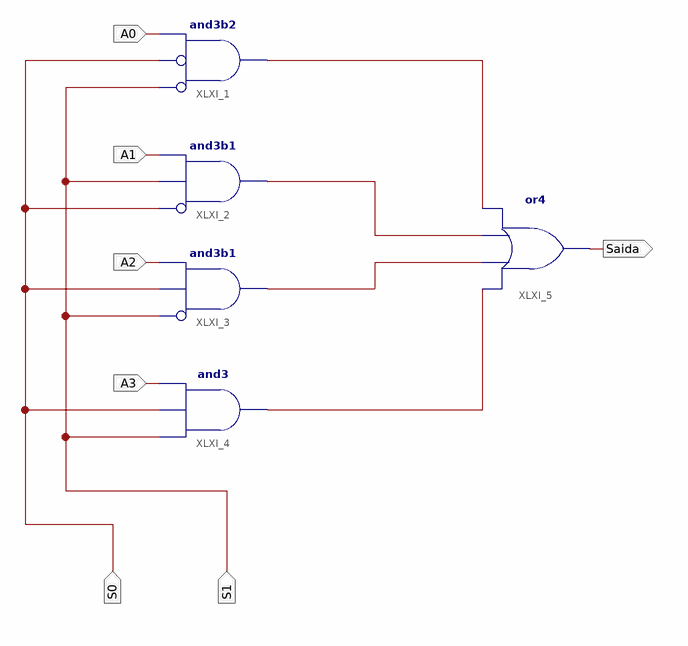
[diagram p0: schematic sheet 1]
// Xilinx ISE schematic Mut.sch (xa9500xl) as structural Verilog: 5 symbols, 7 ports
module Mut (
  input  S0,
  input  S1,
  input  A0,
  input  A1,
  input  A2,
  input  A3,
  output Saida
);

  wire XLXN_1, XLXN_2, XLXN_3, XLXN_4;

  and XLXI_1 (XLXN_1, ~S1, ~S0, A0);  // and3b2
  and XLXI_2 (XLXN_2, ~S0, S1, A1);  // and3b1
  and XLXI_3 (XLXN_3, ~S1, S0, A2);  // and3b1
  and XLXI_4 (XLXN_4, S1, S0, A3);
  or XLXI_5 (Saida, XLXN_4, XLXN_3, XLXN_2, XLXN_1);
endmodule
